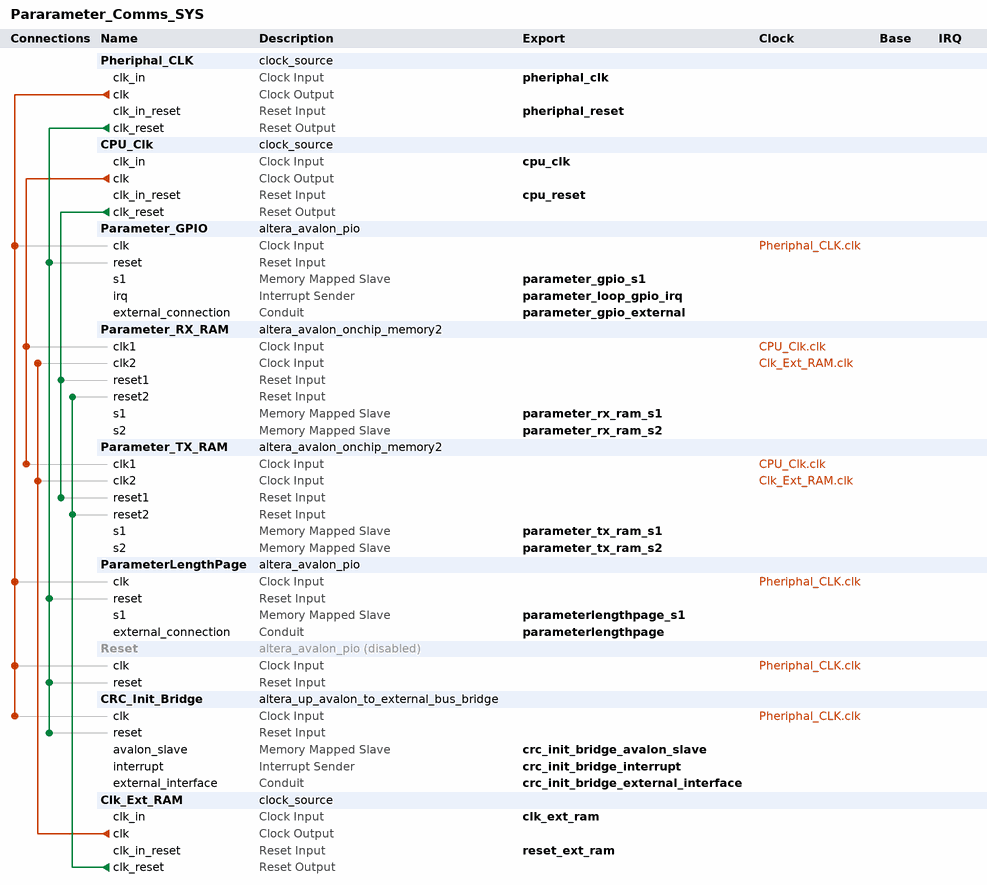
[diagram p0: system contents]
# Platform Designer (Qsys) system Pararameter_Comms_SYS, MAX 10 10M50DAF484I7G
# Parameters at their usual value, and those the tool derives, are not listed.
package require -exact qsys 18.1
create_system Pararameter_Comms_SYS
set_project_property DEVICE_FAMILY {MAX 10}
set_project_property DEVICE 10M50DAF484I7G

add_instance Pheriphal_CLK clock_source 18.1
set_instance_parameter_value Pheriphal_CLK clockFrequency 50000000

add_instance CPU_Clk clock_source 18.1
set_instance_parameter_value CPU_Clk clockFrequency 50000000

add_instance Parameter_GPIO altera_avalon_pio 18.1
set_instance_parameter_value Parameter_GPIO bitModifyingOutReg true
set_instance_parameter_value Parameter_GPIO captureEdge true
set_instance_parameter_value Parameter_GPIO direction InOut
set_instance_parameter_value Parameter_GPIO edgeType FALLING
set_instance_parameter_value Parameter_GPIO generateIRQ true
set_instance_parameter_value Parameter_GPIO irqType EDGE
set_instance_parameter_value Parameter_GPIO simDoTestBenchWiring true
set_instance_parameter_value Parameter_GPIO width 1

add_instance Parameter_RX_RAM altera_avalon_onchip_memory2 18.1
set_instance_parameter_value Parameter_RX_RAM dataWidth 32
set_instance_parameter_value Parameter_RX_RAM dualPort true
set_instance_parameter_value Parameter_RX_RAM initMemContent false
set_instance_parameter_value Parameter_RX_RAM initializationFileName onchip_mem.hex
set_instance_parameter_value Parameter_RX_RAM memorySize 4100

add_instance Parameter_TX_RAM altera_avalon_onchip_memory2 18.1
set_instance_parameter_value Parameter_TX_RAM dataWidth 32
set_instance_parameter_value Parameter_TX_RAM dualPort true
set_instance_parameter_value Parameter_TX_RAM initMemContent false
set_instance_parameter_value Parameter_TX_RAM initializationFileName onchip_mem.hex
set_instance_parameter_value Parameter_TX_RAM memorySize 4100

add_instance ParameterLengthPage altera_avalon_pio 18.1
set_instance_parameter_value ParameterLengthPage captureEdge true
set_instance_parameter_value ParameterLengthPage direction Output
set_instance_parameter_value ParameterLengthPage edgeType FALLING
set_instance_parameter_value ParameterLengthPage generateIRQ true
set_instance_parameter_value ParameterLengthPage irqType EDGE
set_instance_parameter_value ParameterLengthPage width 16

add_instance Reset altera_avalon_pio 18.1
set_instance_property Reset ENABLED false
set_instance_parameter_value Reset bitModifyingOutReg true
set_instance_parameter_value Reset captureEdge true
set_instance_parameter_value Reset direction Output
set_instance_parameter_value Reset edgeType FALLING
set_instance_parameter_value Reset generateIRQ true
set_instance_parameter_value Reset irqType EDGE
set_instance_parameter_value Reset width 1

add_instance CRC_Init_Bridge altera_up_avalon_to_external_bus_bridge 18.0
set_instance_parameter_value CRC_Init_Bridge addr_size 256
set_instance_parameter_value CRC_Init_Bridge addr_size_multiplier bytes
set_instance_parameter_value CRC_Init_Bridge data_size 8

add_instance Clk_Ext_RAM clock_source 18.1
set_instance_parameter_value Clk_Ext_RAM clockFrequency 50000000

# connections
add_connection Clk_Ext_RAM.clk Parameter_RX_RAM.clk2 clock
add_connection Clk_Ext_RAM.clk Parameter_TX_RAM.clk2 clock
add_connection CPU_Clk.clk Parameter_RX_RAM.clk1 clock
add_connection CPU_Clk.clk Parameter_TX_RAM.clk1 clock
add_connection Pheriphal_CLK.clk CRC_Init_Bridge.clk clock
add_connection Pheriphal_CLK.clk Parameter_GPIO.clk clock
add_connection Pheriphal_CLK.clk ParameterLengthPage.clk clock
add_connection Pheriphal_CLK.clk Reset.clk clock
add_connection Clk_Ext_RAM.clk_reset Parameter_RX_RAM.reset2 reset
add_connection Clk_Ext_RAM.clk_reset Parameter_TX_RAM.reset2 reset
add_connection CPU_Clk.clk_reset Parameter_RX_RAM.reset1 reset
add_connection CPU_Clk.clk_reset Parameter_TX_RAM.reset1 reset
add_connection Pheriphal_CLK.clk_reset CRC_Init_Bridge.reset reset
add_connection Pheriphal_CLK.clk_reset Parameter_GPIO.reset reset
add_connection Pheriphal_CLK.clk_reset ParameterLengthPage.reset reset
add_connection Pheriphal_CLK.clk_reset Reset.reset reset

# exported interfaces
add_interface clk_ext_ram clock sink
set_interface_property clk_ext_ram EXPORT_OF Clk_Ext_RAM.clk_in
add_interface cpu_clk clock sink
set_interface_property cpu_clk EXPORT_OF CPU_Clk.clk_in
add_interface cpu_reset reset sink
set_interface_property cpu_reset EXPORT_OF CPU_Clk.clk_in_reset
add_interface crc_init_bridge_avalon_slave avalon slave
set_interface_property crc_init_bridge_avalon_slave EXPORT_OF CRC_Init_Bridge.avalon_slave
add_interface crc_init_bridge_external_interface conduit end
set_interface_property crc_init_bridge_external_interface EXPORT_OF CRC_Init_Bridge.external_interface
add_interface crc_init_bridge_interrupt interrupt sender
set_interface_property crc_init_bridge_interrupt EXPORT_OF CRC_Init_Bridge.interrupt
add_interface parameter_gpio_external conduit end
set_interface_property parameter_gpio_external EXPORT_OF Parameter_GPIO.external_connection
add_interface parameter_gpio_s1 avalon slave
set_interface_property parameter_gpio_s1 EXPORT_OF Parameter_GPIO.s1
add_interface parameter_loop_gpio_irq interrupt sender
set_interface_property parameter_loop_gpio_irq EXPORT_OF Parameter_GPIO.irq
add_interface parameter_rx_ram_s1 avalon slave
set_interface_property parameter_rx_ram_s1 EXPORT_OF Parameter_RX_RAM.s1
add_interface parameter_rx_ram_s2 avalon slave
set_interface_property parameter_rx_ram_s2 EXPORT_OF Parameter_RX_RAM.s2
add_interface parameter_tx_ram_s1 avalon slave
set_interface_property parameter_tx_ram_s1 EXPORT_OF Parameter_TX_RAM.s1
add_interface parameter_tx_ram_s2 avalon slave
set_interface_property parameter_tx_ram_s2 EXPORT_OF Parameter_TX_RAM.s2
add_interface parameterlengthpage conduit end
set_interface_property parameterlengthpage EXPORT_OF ParameterLengthPage.external_connection
add_interface parameterlengthpage_s1 avalon slave
set_interface_property parameterlengthpage_s1 EXPORT_OF ParameterLengthPage.s1
add_interface pheriphal_clk clock sink
set_interface_property pheriphal_clk EXPORT_OF Pheriphal_CLK.clk_in
add_interface pheriphal_reset reset sink
set_interface_property pheriphal_reset EXPORT_OF Pheriphal_CLK.clk_in_reset
add_interface reset_ext_ram reset sink
set_interface_property reset_ext_ram EXPORT_OF Clk_Ext_RAM.clk_in_reset

set_interconnect_requirement {$system} qsys_mm.clockCrossingAdapter HANDSHAKE
set_interconnect_requirement {$system} qsys_mm.enableEccProtection FALSE
set_interconnect_requirement {$system} qsys_mm.insertDefaultSlave FALSE
set_interconnect_requirement {$system} qsys_mm.maxAdditionalLatency 1

save_system Pararameter_Comms_SYS.qsys
